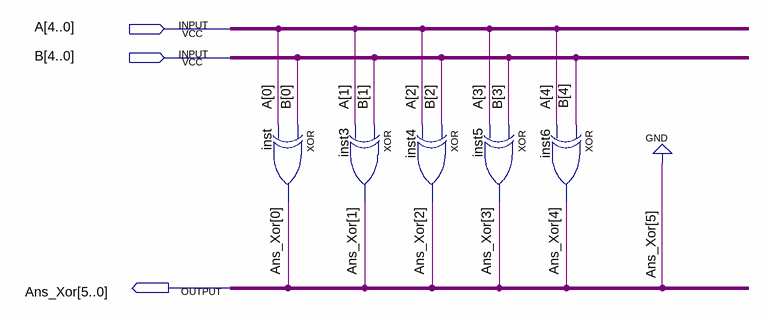
[diagram p0: schematic sheet]
// Quartus schematic xor_bitbit.bdf as structural Verilog: 5 symbols, 3 pins
module xor_bitbit (
  input  [4:0] A,
  input  [4:0] B,
  output [5:0] Ans_Xor
);

  xor inst (Ans_Xor[0], B[0], A[0]);
  xor inst3 (Ans_Xor[1], B[1], A[1]);
  xor inst4 (Ans_Xor[2], B[2], A[2]);
  xor inst5 (Ans_Xor[3], B[3], A[3]);
  xor inst6 (Ans_Xor[4], B[4], A[4]);

  assign Ans_Xor[5] = 1'b0;
endmodule
